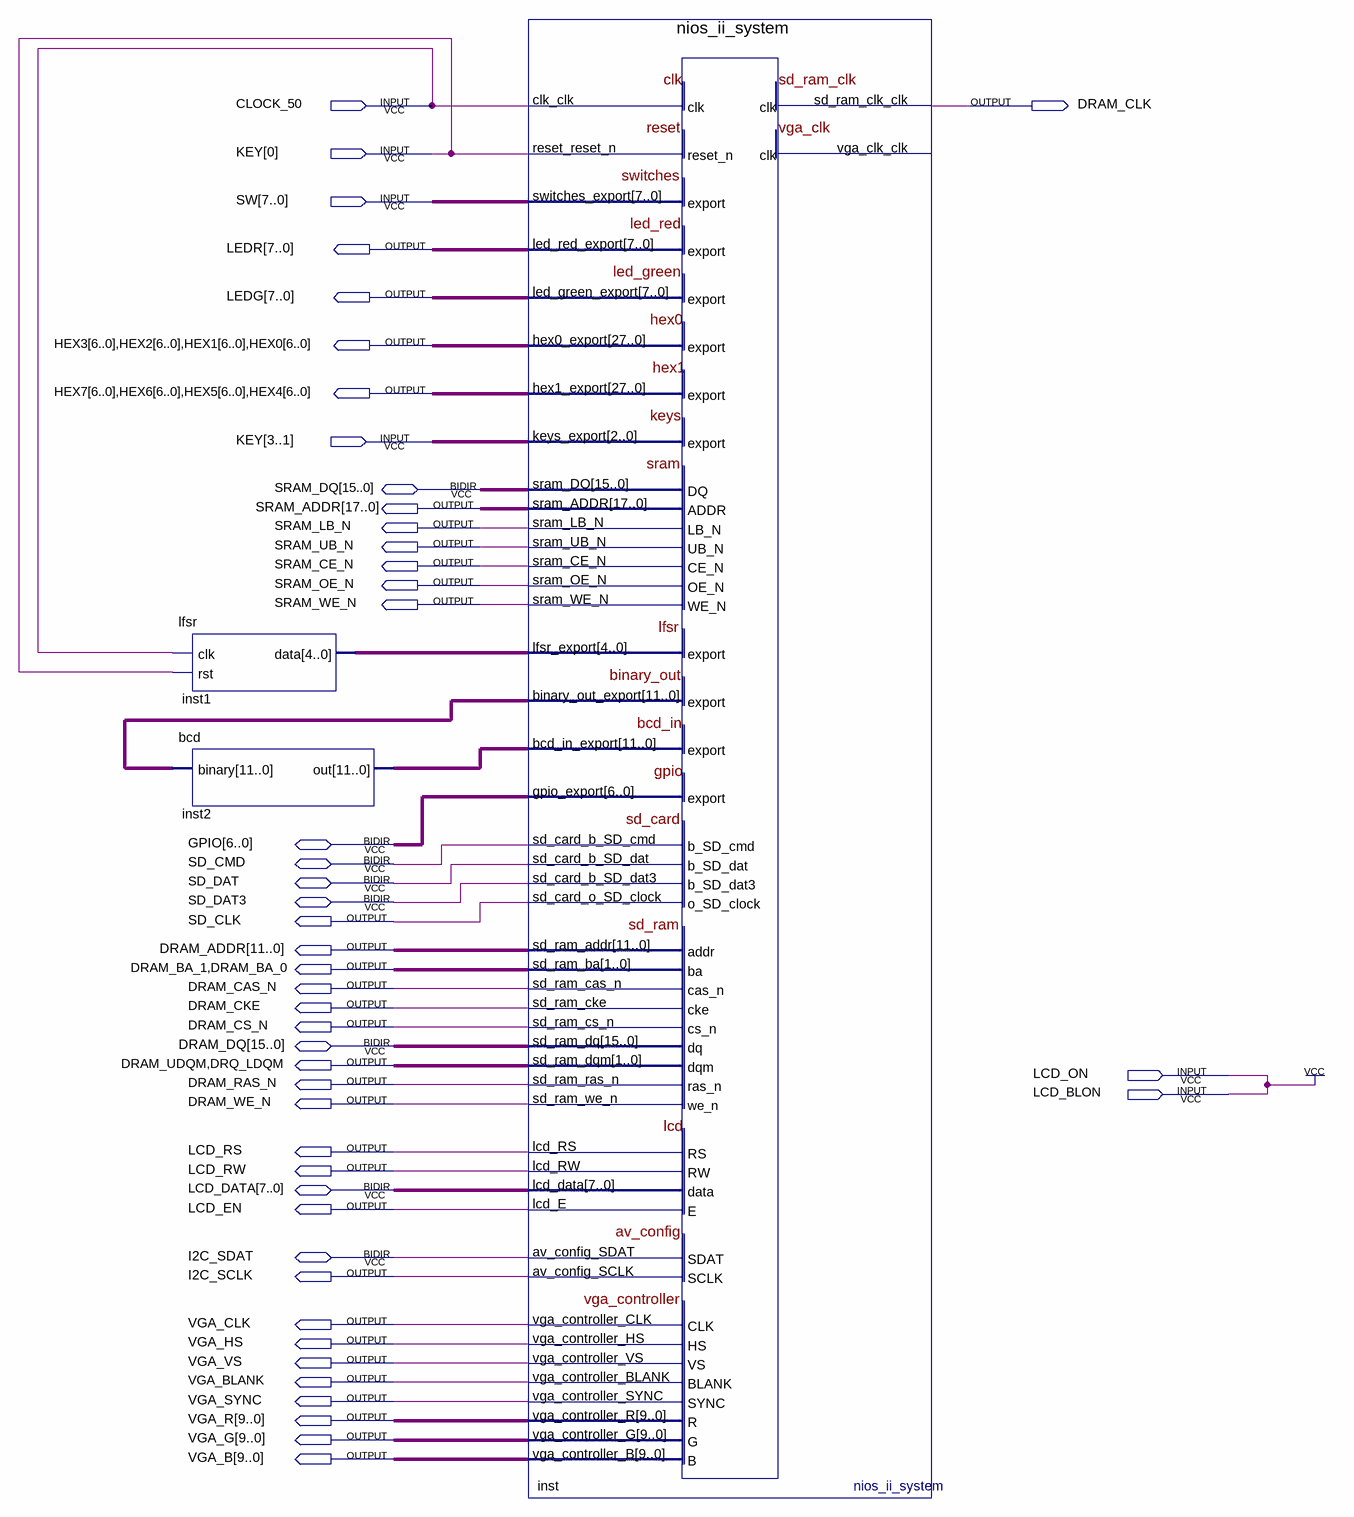
[diagram p0: schematic sheet]
// Quartus schematic final_178_quartus.bdf as structural Verilog: 3 symbols, 46 pins
module final_178_quartus (
  input  CLOCK_50,
  input  [3:0] KEY,
  input  [7:0] SW,
  input  LCD_ON,
  input  LCD_BLON,
  inout  [15:0] SRAM_DQ,
  inout  [6:0] GPIO,
  inout  SD_CMD,
  inout  SD_DAT,
  inout  SD_DAT3,
  inout  [15:0] DRAM_DQ,
  inout  [7:0] LCD_DATA,
  inout  I2C_SDAT,
  output DRAM_CLK,
  output [7:0] LEDR,
  output [7:0] LEDG,
  output [6:0] HEX3,
  output [6:0] HEX2,
  output [6:0] HEX1,
  output [6:0] HEX0,
  output [6:0] HEX7,
  output [6:0] HEX6,
  output [6:0] HEX5,
  output [6:0] HEX4,
  output [17:0] SRAM_ADDR,
  output SRAM_LB_N,
  output SRAM_UB_N,
  output SRAM_CE_N,
  output SRAM_OE_N,
  output SRAM_WE_N,
  output SD_CLK,
  output [11:0] DRAM_ADDR,
  output DRAM_BA_1,
  output DRAM_BA_0,
  output DRAM_CAS_N,
  output DRAM_CKE,
  output DRAM_CS_N,
  output DRAM_UDQM,
  output DRQ_LDQM,
  output DRAM_RAS_N,
  output DRAM_WE_N,
  output LCD_RS,
  output LCD_RW,
  output LCD_EN,
  output I2C_SCLK,
  output VGA_CLK,
  output VGA_HS,
  output VGA_VS,
  output VGA_BLANK,
  output VGA_SYNC,
  output [9:0] VGA_R,
  output [9:0] VGA_G,
  output [9:0] VGA_B
);

  wire [4:0] inst1_data;
  wire [11:0] inst2_out, inst_binary_out_export;

  lfsr inst1 (.clk(CLOCK_50), .rst(KEY[0]), .data(inst1_data));
  bcd inst2 (.binary(inst_binary_out_export), .out(inst2_out));
  nios_ii_system inst (
    .clk_clk(CLOCK_50), .reset_reset_n(KEY[0]), .switches_export(SW), .keys_export(KEY[3:1]),
    .lfsr_export(inst1_data), .bcd_in_export(inst2_out), .led_red_export(LEDR), .led_green_export(LEDG),
    .hex0_export({HEX3, HEX2, HEX1, HEX0}), .hex1_export({HEX7, HEX6, HEX5, HEX4}), .sram_ADDR(SRAM_ADDR),
    .sram_LB_N(SRAM_LB_N), .sram_UB_N(SRAM_UB_N), .sram_CE_N(SRAM_CE_N), .sram_OE_N(SRAM_OE_N),
    .sram_WE_N(SRAM_WE_N), .binary_out_export(inst_binary_out_export), .sd_card_o_SD_clock(SD_CLK),
    .sd_ram_addr(DRAM_ADDR), .sd_ram_ba({DRAM_BA_1, DRAM_BA_0}), .sd_ram_cas_n(DRAM_CAS_N),
    .sd_ram_cke(DRAM_CKE), .sd_ram_cs_n(DRAM_CS_N), .sd_ram_dqm({DRAM_UDQM, DRQ_LDQM}),
    .sd_ram_ras_n(DRAM_RAS_N), .sd_ram_we_n(DRAM_WE_N), .sd_ram_clk_clk(DRAM_CLK), .lcd_RS(LCD_RS),
    .lcd_RW(LCD_RW), .lcd_E(LCD_EN), .av_config_SCLK(I2C_SCLK), .vga_controller_CLK(VGA_CLK),
    .vga_controller_HS(VGA_HS), .vga_controller_VS(VGA_VS), .vga_controller_BLANK(VGA_BLANK),
    .vga_controller_SYNC(VGA_SYNC), .vga_controller_R(VGA_R), .vga_controller_G(VGA_G),
    .vga_controller_B(VGA_B), .sram_DQ(SRAM_DQ), .gpio_export(GPIO), .sd_card_b_SD_cmd(SD_CMD),
    .sd_card_b_SD_dat(SD_DAT), .sd_card_b_SD_dat3(SD_DAT3), .sd_ram_dq(DRAM_DQ), .lcd_data(LCD_DATA),
    .av_config_SDAT(I2C_SDAT));  // open: vga_clk_clk

  assign LCD_ON = LCD_BLON;
  // also tied to VCC on the sheet: LCD_BLON
endmodule
